# EAGLE design DAM1941_headphone (EAGLE 9.3.1)
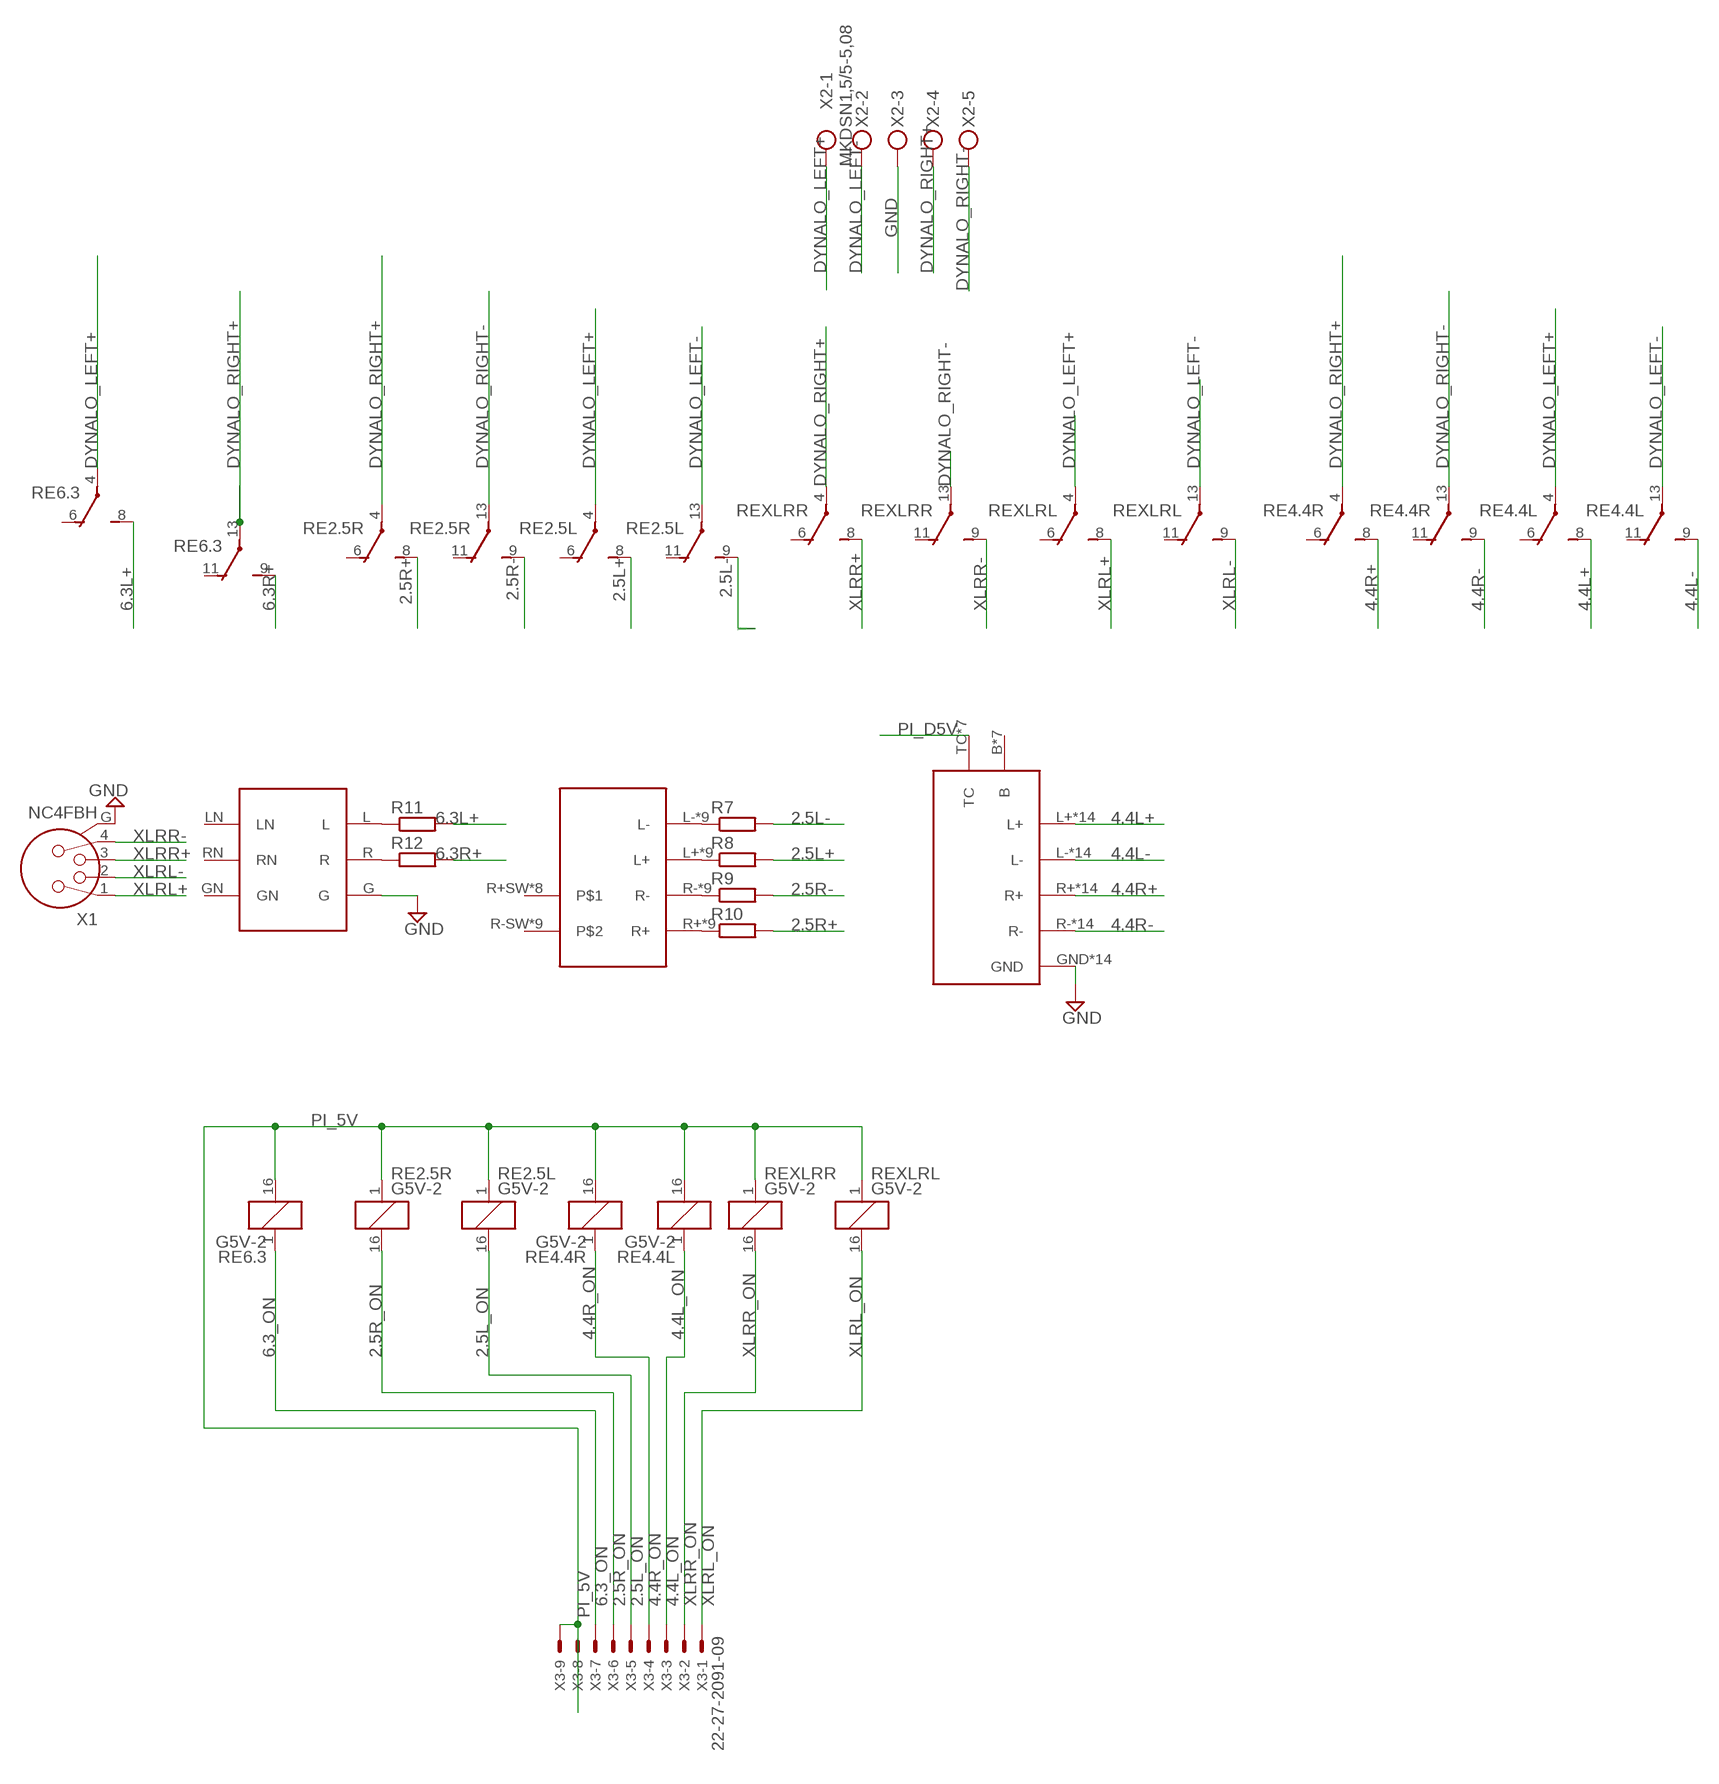
[diagram p0: schematic, sheet 1]

## Parts
R7  R-EU_MELF0204R  [MINI_MELF-0204R]
R8  R-EU_MELF0204R  [MINI_MELF-0204R]
R9  R-EU_MELF0204R  [MINI_MELF-0204R]
R10  R-EU_MELF0204R  [MINI_MELF-0204R]
R11  R-EU_MELF0204R  [MINI_MELF-0204R]
R12  R-EU_MELF0204R  [MINI_MELF-0204R]
RE2.5L  G5V-2  [G5V-2]
RE2.5R  G5V-2  [G5V-2]
RE4.4L  G5V-2  [G5V-2]
RE4.4R  G5V-2  [G5V-2]
RE6.3  G5V-2  [G5V-2]
REXLRL  G5V-2  [G5V-2]
REXLRR  G5V-2  [G5V-2]
U$1  PANTACON_JACK  [PATNACON_JACK]
U$2  CUI2.5MM  [CUI2.5MM]
U$3  NMJ6HCD3  [NMJ6HCD3-AU]
X1  NC4FBH  [NC4FBH]
X2  MKDSN1,5/5-5,08  [MKDSN1,5/5-5,08]
X3  22-27-2091-09  [6410-09]

## Nets
2.5L+: R8.2 RE2.5L.8(1:S)
2.5L-: R7.2 RE2.5L.9(2:S)
2.5L_ON: RE2.5L.16 X3.5
2.5R+: R10.2 RE2.5R.8(1:S)
2.5R-: R9.2 RE2.5R.9(2:S)
2.5R_ON: RE2.5R.16 X3.6
4.4L+: RE4.4L.8(1:S) U$1.L+ U$1.L+1(L+) U$1.L+2(L+) U$1.L+3(L+) U$1.L+4(L+) U$1.L+5(L+) U$1.L+6(L+) U$1.L+7(L+) U$1.L+8(L+) U$1.L+9(L+) U$1.L+10(L+) U$1.L+11(L+) U$1.L+12(L+) U$1.L+13(L+)
4.4L-: RE4.4L.9(2:S) U$1.L- U$1.L-1(L-) U$1.L-2(L-) U$1.L-3(L-) U$1.L-4(L-) U$1.L-5(L-) U$1.L-6(L-) U$1.L-7(L-) U$1.L-8(L-) U$1.L-9(L-) U$1.L-10(L-) U$1.L-11(L-) U$1.L-12(L-) U$1.L-13(L-)
4.4L_ON: RE4.4L.1 X3.3
4.4R+: RE4.4R.8(1:S) U$1.R+ U$1.R+1(R+) U$1.R+2(R+) U$1.R+3(R+) U$1.R+4(R+) U$1.R+5(R+) U$1.R+6(R+) U$1.R+7(R+) U$1.R+8(R+) U$1.R+9(R+) U$1.R+10(R+) U$1.R+11(R+) U$1.R+12(R+) U$1.R+13(R+)
4.4R-: RE4.4R.9(2:S) U$1.R- U$1.R-1(R-) U$1.R-2(R-) U$1.R-3(R-) U$1.R-4(R-) U$1.R-5(R-) U$1.R-6(R-) U$1.R-7(R-) U$1.R-8(R-) U$1.R-9(R-) U$1.R-10(R-) U$1.R-11(R-) U$1.R-12(R-) U$1.R-13(R-)
4.4R_ON: RE4.4R.1 X3.4
6.3_ON: RE6.3.1 X3.7
6.3L+: R11.2 RE6.3.8(1:S)
6.3R+: R12.2 RE6.3.9(2:S)
DYNALO_LEFT+: RE2.5L.4(1:P) RE4.4L.4(1:P) RE6.3.4(1:P) REXLRL.4(1:P) X2.1
DYNALO_LEFT-: RE2.5L.13(2:P) RE4.4L.13(2:P) REXLRL.13(2:P) X2.2
DYNALO_RIGHT+: RE2.5R.4(1:P) RE4.4R.4(1:P) RE6.3.13(2:P) REXLRR.4(1:P) X2.4
DYNALO_RIGHT-: RE2.5R.13(2:P) RE4.4R.13(2:P) REXLRR.13(2:P) X2.5
GND: U$1.GND U$1.GND1(GND) U$1.GND2(GND) U$1.GND3(GND) U$1.GND4(GND) U$1.GND5(GND) U$1.GND6(GND) U$1.GND7(GND) U$1.GND8(GND) U$1.GND9(GND) U$1.GND10(GND) U$1.GND11(GND) U$1.GND12(GND) U$1.GND13(GND) U$3.G X1.G X2.3
N$1: R7.1 U$2.L- U$2.L-1(L-) U$2.L-2(L-) U$2.L-3(L-) U$2.L-4(L-) U$2.L-5(L-) U$2.L-6(L-) U$2.L-7(L-) U$2.L-8(L-)
N$2: R8.1 U$2.L+ U$2.L+1(L+) U$2.L+2(L+) U$2.L+3(L+) U$2.L+4(L+) U$2.L+5(L+) U$2.L+6(L+) U$2.L+7(L+) U$2.L+8(L+)
N$3: R9.1 U$2.R- U$2.R-1(R-) U$2.R-2(R-) U$2.R-3(R-) U$2.R-4(R-) U$2.R-5(R-) U$2.R-6(R-) U$2.R-7(R-) U$2.R-8(R-)
N$4: R10.1 U$2.R+ U$2.R+1(R+) U$2.R+2(R+) U$2.R+3(R+) U$2.R+4(R+) U$2.R+5(R+) U$2.R+6(R+) U$2.R+7(R+) U$2.R+8(R+)
N$5: R11.1 U$3.L
N$8: R12.1 U$3.R
PI_5V: RE2.5L.1 RE2.5R.1 RE4.4L.16 RE4.4R.16 RE6.3.16 REXLRL.1 REXLRR.1 X3.8 X3.9
PI_D5V: U$1.TC U$1.TC1(TC) U$1.TC2(TC) U$1.TC3(TC) U$1.TC4(TC) U$1.TC5(TC) U$1.TC6(TC)
XLRL+: REXLRL.8(1:S) X1.1
XLRL-: REXLRL.9(2:S) X1.2
XLRL_ON: REXLRL.16 X3.1
XLRR+: REXLRR.8(1:S) X1.3
XLRR-: REXLRR.9(2:S) X1.4
XLRR_ON: REXLRR.16 X3.2
Unconnected: RE2.5L.6(1:O) RE2.5L.11(2:O) RE2.5R.6(1:O) RE2.5R.11(2:O) RE4.4L.6(1:O) RE4.4L.11(2:O) RE4.4R.6(1:O) RE4.4R.11(2:O) RE6.3.6(1:O) RE6.3.11(2:O) REXLRL.6(1:O) REXLRL.11(2:O) REXLRR.6(1:O) REXLRR.11(2:O) U$1.B U$1.B1(B) U$1.B2(B) U$1.B3(B) U$1.B4(B) U$1.B5(B) U$1.B6(B) U$2.R+SW U$2.R+SW1 U$2.R+SW2 U$2.R+SW3 U$2.R+SW5 U$2.R+SW6 U$2.R+SW7 U$2.R+SW8 U$2.R-SW U$2.R-SW1 U$2.R-SW2 U$2.R-SW3 U$2.R-SW4 U$2.R-SW5 U$2.R-SW6 U$2.R-SW7 U$2.R-SW8 U$3.GN U$3.LN U$3.RN

## Library data of the parts
R7-R12 = Vwvwbg:R-EU_: RESISTOR, European symbol
RE2.5L RE2.5R RE4.4L RE4.4R RE6.3 REXLRL REXLRR = relay:G5V-2: OMRON PCB Relay Source: http://www.omron.com/ecb/products/pdf/en-g5v2.pdf; MPN: G5V-2 5DC; OC_FARNELL: 9949488; OC_NEWARK: 78K5703
U$1 = Vwvwbg:PANTACON_JACK
U$2 = Vwvwbg:CUI2.5MM
U$3 = Vwvwbg:NMJ6HCD3
X1 = con-neutrik_ag:NC4: Neutrik Audio Connector XLR SERIES Stereo 1/4" jack Source: www.neutrik.com/; OC_FARNELL: unknown; OC_NEWARK: unknown
X2 = Vwvwbg:MKDSN1,5/5-5,08: MKDSN 1,5/ 5-5,08 Printklemme Nennstrom: 13,5 A Nennspannung: 250 V Rastermaß: 5,08 mm Polzahl: 5 Anschlussart: Schraubanschluss Montage: Löten Anschlussrichtung Leiter/Platine: 0 ° Artikelnummer: 1729157 Source: http://eshop.phoenixcontact.com .. 1729157.pdf
X3 = con-molex:22-?-09: CONNECTOR wire to board 2.54 mm (.1 inch) pitch header; MF: MOLEX; OC_FARNELL: unknown; OC_NEWARK: unknown

## Board
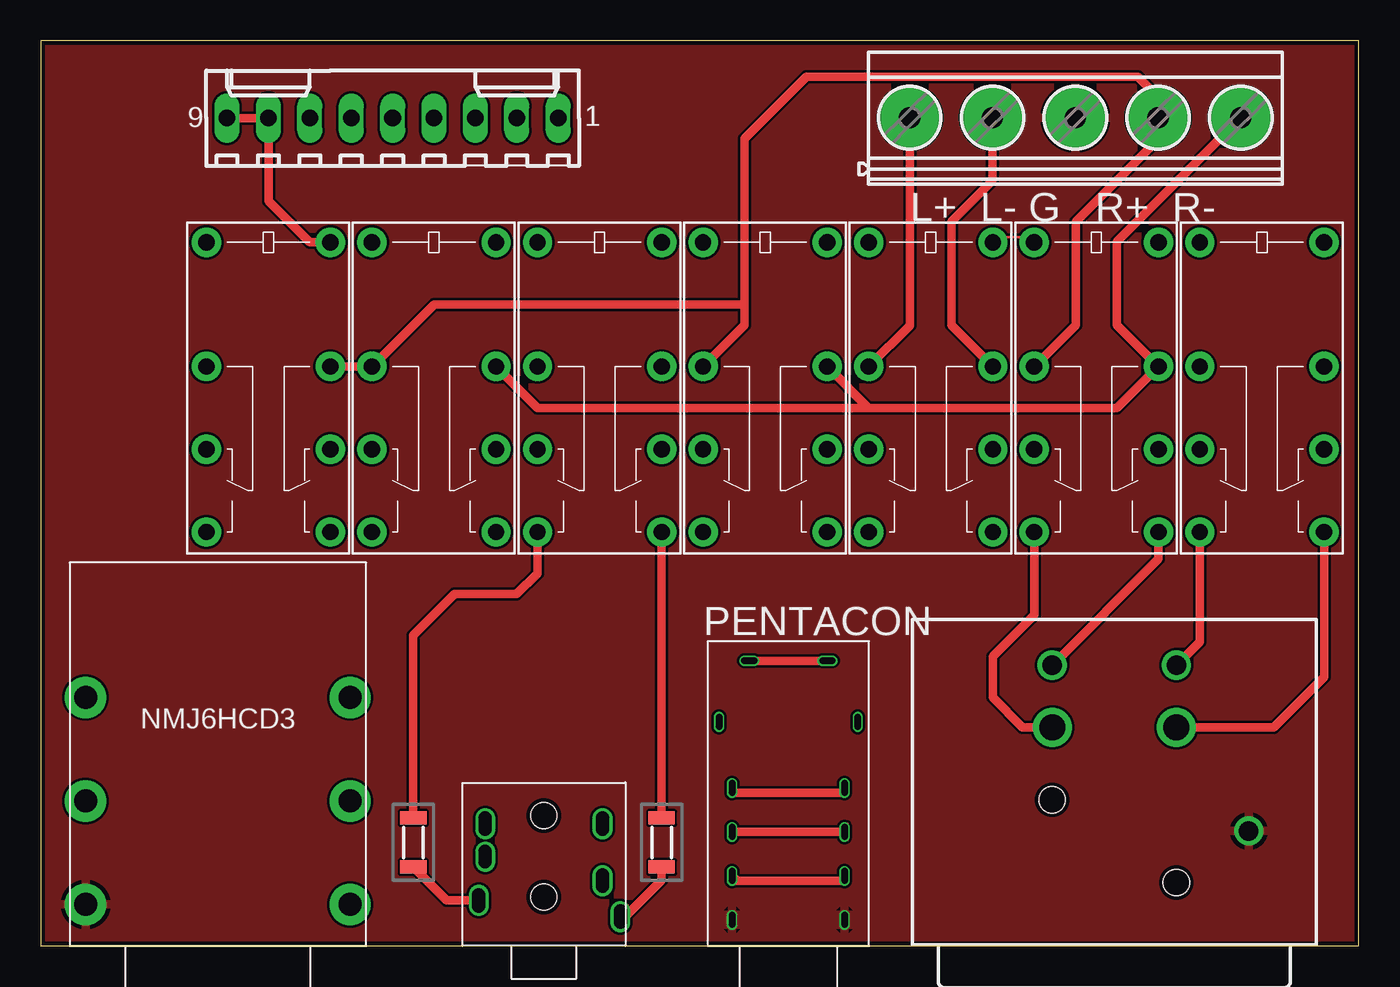
[diagram p1: board, top side]
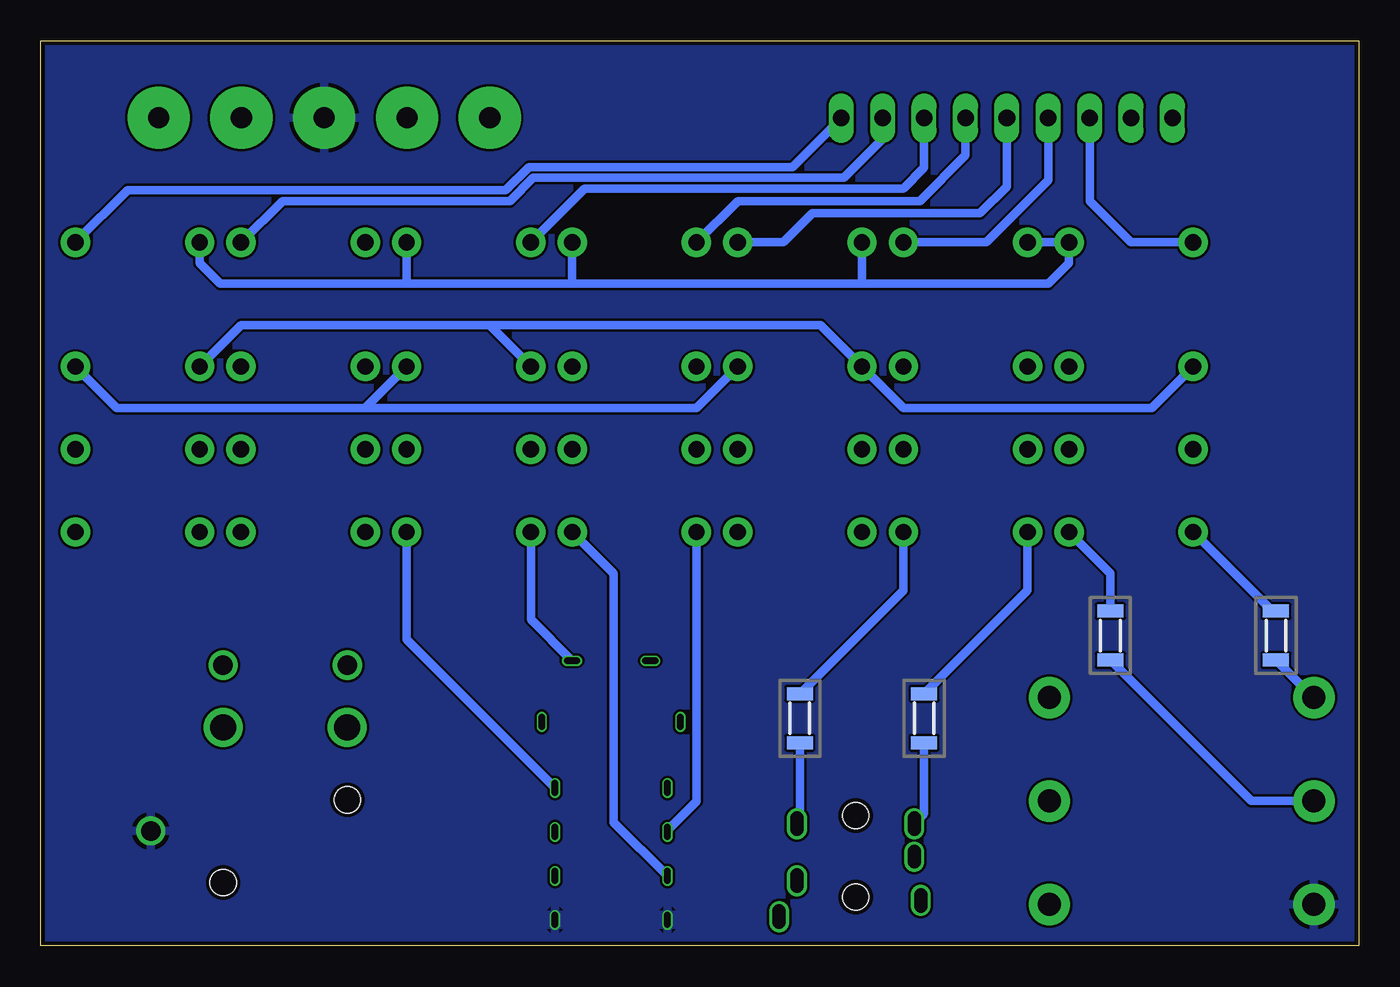
[diagram p2: board, bottom side, seen from below]

Size 80.87 x 55.55 mm. Coordinates in mm from the lower left corner, seen from the top.
Outline: 0,0 80.87,0 80.87,55.55 0,55.55 0,0
Copper layers (1*16): Top 0.035mm / dielectric 1.5mm / Bottom 0.035mm
Design rules "default *": minimum track width 6mil, minimum drill 0.35mm, track to track 6mil, track to pad 6mil, pad to pad 6mil, via to via 6mil, smd to smd 6mil, copper to edge 10mil, drill to drill 6mil, minimum pad ring 0mil, minimum via ring 4mil, stop-mask expansion 4mil, vias tented up to drill 0mil, thermal gap 10mil

### Footprints (pad centres in the part's own frame; a part is rotated, then mirrored left to right if it is on the bottom)
MINI_MELF-0204R = smd 0.8 x 1.6: 1 -1.5,0; 2 1.5,0
G5V-2 = drill 1 pad 1.8: 1 -8.89,-3.81; 4 -1.27,-3.81; 6 3.81,-3.81; 8 8.89,-3.81; 9 8.89,3.81; 11 3.81,3.81; 13 -1.27,3.81; 16 -8.89,3.81
PATNACON_JACK = drill 0.4 pad 0.6: B -4.25,13.75; B1 -4.25,13.85; B2 -4.25,13.95; B3 -4.25,14.05; B4 -4.25,13.65; B5 -4.25,13.55; B6 -4.25,13.45; GND 3.45,1.6; GND1 3.45,1.7; GND2 -3.45,1.6; GND3 3.45,1.8; GND4 3.45,1.9; GND5 3.45,1.5; GND6 3.45,1.4; GND7 3.45,1.3; GND8 -3.45,1.7; GND9 -3.45,1.8; GND10 -3.45,1.9; GND11 -3.45,1.5; GND12 -3.45,1.4; GND13 -3.45,1.3; L+ 2.4,17.5; L+1 2.5,17.5; L+2 -2.4,17.5; L+3 2.6,17.5; L+4 2.7,17.5; L+5 2.3,17.5; L+6 2.2,17.5; L+7 2.1,17.5; L+8 -2.3,17.5; L+9 -2.2,17.5; L+10 -2.1,17.5; L+11 -2.5,17.5; L+12 -2.6,17.5; L+13 -2.7,17.5; L- 3.45,9.7; L-1 3.45,9.6; L-2 -3.45,9.7; L-3 3.45,9.5; L-4 3.45,9.4; L-5 3.45,9.8; L-6 3.45,9.9; L-7 3.45,10; L-8 -3.45,9.8; L-9 -3.45,9.9; L-10 -3.45,10; L-11 -3.45,9.6; L-12 -3.45,9.5; L-13 -3.45,9.4; R+ 3.45,7; R+1 3.45,6.9; R+2 -3.45,7; R+3 3.45,6.8; R+4 3.45,6.7; R+5 3.45,7.1; R+6 3.45,7.2; R+7 3.45,7.3; R+8 -3.45,7.1; R+9 -3.45,7.2; R+10 -3.45,7.3; R+11 -3.45,6.9; R+12 -3.45,6.8; R+13 -3.45,6.7; R- 3.45,4.3; R-1 3.45,4.2; R-2 -3.45,4.3; R-3 3.45,4; R-4 3.45,4.4; R-5 3.45,4.5; R-6 3.45,4.6; R-7 -3.45,4.4; R-8 -3.45,4.5; R-9 3.45,4.1; R-10 -3.45,4.6; R-11 -3.45,4.2; R-12 -3.45,4.1; R-13 -3.45,4; TC 4.25,13.75; TC1 4.25,13.85; TC2 4.25,13.95; TC3 4.25,14.05; TC4 4.25,13.65; TC5 4.25,13.55; TC6 4.25,13.45
CUI2.5MM = drill 0.8 pad 1.1: L+ -4,2.8; L+1 -4,2.9; L+2 -4,3; L+3 -4,3.1; L+4 -4,3.15; L+5 -4,2.7; L+6 -4,2.6; L+7 -4,2.5; L+8 -4,2.45; L- 4.7,1.8; L-1 4.7,1.9; L-2 4.7,2; L-3 4.7,2.1; L-4 4.7,1.7; L-5 4.7,1.6; L-6 4.7,1.5; L-7 4.7,2.15; L-8 4.7,1.45; R+ -3.6,7.5; R+1 -3.6,7.6; R+2 -3.6,7.7; R+3 -3.6,7.8; R+4 -3.6,7.85; R+5 -3.6,7.4; R+6 -3.6,7.3; R+7 -3.6,7.2; R+8 -3.6,7.15; R+SW -3.6,5.5; R+SW1 -3.6,5.6; R+SW2 -3.6,5.7; R+SW3 -3.6,5.8; R+SW5 -3.6,5.4; R+SW6 -3.6,5.3; R+SW7 -3.6,5.2; R+SW8 -3.6,5.15; R- 3.6,7.5; R-1 3.6,7.6; R-2 3.6,7.7; R-3 3.6,7.8; R-4 3.6,7.85; R-5 3.6,7.4; R-6 3.6,7.3; R-7 3.6,7.2; R-8 3.6,7.15; R-SW 3.6,4; R-SW1 3.6,4.1; R-SW2 3.6,4.2; R-SW3 3.6,4.3; R-SW4 3.6,4.35; R-SW5 3.6,3.9; R-SW6 3.6,3.8; R-SW7 3.6,3.7; R-SW8 3.6,3.65 | hole 1.6: 0,3; 0,8
NMJ6HCD3-AU = drill 1.4 pad 2.54: G -8.115,2.55; GN 8.115,2.55; L -8.115,15.25; LN 8.115,15.25; R -8.115,8.9; RN 8.115,8.9
NC4FBH = drill 1.2: 1 -3.81,0.55; 4 3.81,0.55; G -8.25,10.72 | drill 1.6: 2 -3.81,4.365; 3 3.81,4.365 | hole 1.6: -3.81,13.89; 3.81,8.81
MKDSN1,5/5-5,08 = drill 1.3 pad 3.81: 1 -10.181,0.025; 2 -5.101,0.025; 3 -0.021,0.025; 4 5.059,0.025; 5 10.139,0.025
6410-09 = drill 1.016 long: 1 10.16,0; 2 7.62,0; 3 5.08,0; 4 2.54,0; 5 0,0; 6 -2.54,0; 7 -5.08,0; 8 -7.62,0; 9 -10.16,0

### Placement (x,y rotation side)
R7  38.1,6.35 90 top
R8  22.86,6.35 90 top
R9  34.29,13.97 90 bottom
R10  26.67,13.97 90 bottom
R11  5.08,19.05 90 bottom
R12  15.24,19.05 90 bottom
RE2.5L  34.29,34.29 270 top
RE2.5R  24.13,34.29 270 top
RE4.4L  54.61,34.29 270 top
RE4.4R  44.45,34.29 270 top
RE6.3  13.97,34.29 270 top
REXLRL  74.93,34.29 270 top
REXLRR  64.77,34.29 270 top
U$1  45.87,0 0 top
U$2  30.87,0 0 top
U$3  10.87,0 0 top
X1  65.87,17.78 180 top
X2  63.5,50.8 0 top
X3  21.59,50.8 0 top

### Tracks (layer width: path | path; a pad name or v marks a point on that pad's centre or on a via)
2.5L+
  Top 0.508: R8.2 22.86,19.05 25.4,21.59 29.21,21.59 30.48,22.86 RE2.5L.8
2.5L-
  Top 0.508: R7.2 RE2.5L.9
2.5L_ON
  Bottom 0.508: X3.5 21.59,46.61 23.24,44.96 33.53,44.96 35.31,43.18 RE2.5L.16
2.5R+
  Bottom 0.508: R10.2 20.32,21.82 RE2.5R.8
2.5R-
  Bottom 0.508: R9.2 27.94,21.82 RE2.5R.9
2.5R_ON
  Bottom 0.508: X3.6 19.05,46.99 22.86,43.18 RE2.5R.16
4.4L+
  Top 0.152: U$1.L+4 U$1.L+1 | U$1.L+13 U$1.L+12 | U$1.L+2 U$1.L+11 U$1.L+12 | U$1.L+12 U$1.L+9 U$1.L+8 | 48,17.5 U$1.L+
  Top 0.508: U$1.L+9 U$1.L+10 U$1.L+7 48,17.5 U$1.L+6 U$1.L+5 U$1.L+ U$1.L+1
  Bottom 0.508: RE4.4L.8 50.8,20.03 U$1.L+ U$1.L+3
4.4L-
  Top 0.152: 49.5,10 U$1.L-6 | 49.5,10 U$1.L-7 | 49.5,10 U$1.L-5 | 42.5,10 U$1.L-9 | 42.5,10 U$1.L-8 | 49.5,9.5 U$1.L-3 | 49.5,9.5 U$1.L-4 | 42.5,9.5 U$1.L-11 | 42.5,9.5 U$1.L-12 | 42.5,9.5 U$1.L-2 | 42.5,9.5 42.5,10 | 42.5,10 U$1.L-10 | 42.5,9.5 U$1.L-13 | 49.5,9.5 U$1.L- | 49.5,9.5 U$1.L-1
  Top 0.508: U$1.L-13 49.12,9.4 U$1.L-1
  Bottom 0.152: U$1.L-7 49.5,10 49.56,9.94
  Bottom 0.508: U$1.L- 49.56,9.94 58.42,18.8 RE4.4L.9
4.4L_ON
  Bottom 0.508: X3.3 26.67,47.75 27.94,46.48 47.5,46.48 RE4.4L.1
4.4R+
  Top 0.152: 42.5,7 42.5,6.5 U$1.R+13 | 42.5,7 U$1.R+2 | 42.5,7 U$1.R+12 | 42.5,7 42.5,7.5 U$1.R+10 | 42.5,7 U$1.R+11 | 42.5,7 U$1.R+8 | 42.5,7 U$1.R+9 | 49.5,7 49.5,6.5 U$1.R+4 | 49.5,7 U$1.R+3 | 49.5,7 U$1.R+1 | 49.5,7 U$1.R+5 | 49.5,7 49.5,7.5 U$1.R+7 | 49.5,7 U$1.R+ | 49.5,7 U$1.R+6
  Top 0.508: U$1.R+ 42.62,7 U$1.R+9
  Bottom 0.508: RE4.4R.8 40.64,8.88 U$1.R+8
4.4R-
  Top 0.152: 49.5,4.5 U$1.R-6 | 49.5,4.5 U$1.R- | 49.5,4.5 U$1.R-4 | 42.5,4 U$1.R-12 | 42.5,4 U$1.R-13 | 49.5,4 U$1.R-1 | 49.5,4 U$1.R-9 | 42.5,4.5 U$1.R-8 | 42.5,4.5 U$1.R-7 | 42.5,4.5 U$1.R-2 | 42.5,4.5 U$1.R-10 | 42.5,4 U$1.R-11 | 42.5,4 42.61,4.11 | 49.5,4 49.5,4.5 | 49.5,4.5 U$1.R-5 | 49.5,4 U$1.R-3
  Top 0.508: U$1.R-3 42.72,4 42.61,4.11 U$1.R-2
  Bottom 0.508: RE4.4R.9 45.72,22.86 45.72,7.6 U$1.R-2
4.4R_ON
  Bottom 0.508: X3.4 24.13,48.51 26.92,45.72 38.1,45.72 RE4.4R.1
6.3_ON
  Bottom 0.508: X3.7 16.51,45.72 13.97,43.18 RE6.3.1
6.3L+
  Bottom 0.508: R11.2 5.31,20.55 RE6.3.8
6.3R+
  Bottom 0.508: RE6.3.9 15.24,22.86 R12.2
DYNALO_LEFT+
  Top 0.508: X2.1 53.32,38.08 RE4.4L.4
  Bottom 0.508: REXLRL.4 68.58,38.1 53.34,38.1 | 53.34,38.1 RE4.4L.4 | 53.34,38.1 33.02,38.1 RE2.5L.4 27.94,33.02 12.7,33.02 RE6.3.4
DYNALO_LEFT-
  Top 0.508: X2.2 58.4,46.97 55.88,44.45 55.88,38.1 RE4.4L.13
  Bottom 0.508: RE4.4L.13 60.96,33.02 | 60.96,33.02 76.2,33.02 REXLRL.13 | RE2.5L.13 40.64,33.02 60.96,33.02
DYNALO_RIGHT+
  Top 0.508: X2.4 68.56,50.8 | 68.56,50.8 68.56,49.51 63.5,44.45 63.5,38.1 REXLRR.4 | RE4.4R.4 43.18,38.1 43.18,39.37 | 43.18,39.37 43.18,49.53 46.99,53.34 67.31,53.34 69.85,50.8 68.56,50.8 | RE6.3.13 RE2.5R.4 24.13,39.37 43.18,39.37
DYNALO_RIGHT-
  Top 0.508: X2.5 66.04,43.23 66.04,38.1 REXLRR.13 66.04,33.02 50.8,33.02 | 50.8,33.02 RE4.4R.13 | RE2.5R.13 30.48,33.02 50.8,33.02
GND
  pour Bottom: 0,57.15 83.82,57.15 83.82,-3.81 -1.27,-3.81 -1.27,57.15
  pour Top: -2.54,57.15 83.82,57.15 83.82,-3.81 -2.54,-3.81
N$1
  Top 0.152: U$2.L-8 35.5,1.5 U$2.L-1 36,2 | U$2.L-3 36,2.5 U$2.L-7 | 36,2 U$2.L-4 35.5,2 | 36,2 U$2.L-2 | 35.5,2 U$2.L-3 | 35.5,2 U$2.L- | 36,2 U$2.L-3 | 36,2 U$2.L-5 | 36,2 36.03,1.97
  Top 0.508: U$2.L-6 36.03,1.97 38.1,4.03 R7.1
N$2
  Top 0.152: 27,3 U$2.L+3 | 27,3 U$2.L+5 | 27,2.5 U$2.L+7 | 27,3 U$2.L+4 | 27,3 U$2.L+1 27,2.5 | 27,3 U$2.L+6 | 27,2.5 U$2.L+8 27,3 | 27,3 U$2.L+2 | 27,3 U$2.L+
  Top 0.508: R8.1 24.91,2.8 U$2.L+
N$3
  Top 0.152: 34.5,7.5 U$2.R-5 | 34.5,7.5 U$2.R-8 | 34.5,7.5 U$2.R-7 | 34.5,8 U$2.R-4 | 34.5,8 U$2.R-1 | 34.5,8 U$2.R-3 34.5,7.5 | 34.5,8 U$2.R-2 | 34.5,7.5 U$2.R-6 | 34.5,7.5 U$2.R-
  Bottom 0.508: U$2.R- 34.29,7.68 R9.1
N$4
  Top 0.152: 27.5,7.5 U$2.R+3 | 27.5,7.5 U$2.R+7 | 27.5,7.5 U$2.R+8 | 27.5,7.5 U$2.R+1 27.5,8 | 27.5,7.5 U$2.R+6 | 27.5,7.5 U$2.R+4 27.5,8 | 27.5,8 U$2.R+2 27.5,7.5 | 27.5,7.5 U$2.R+5 | 27.5,7.5 U$2.R+
  Bottom 0.508: R10.1 26.67,8.1 U$2.R+
N$5
  Bottom 0.508: U$3.L 2.78,15.25 R11.1
N$8
  Bottom 0.508: R12.1 6.59,8.9 U$3.R
PI_5V
  Top 0.152: REXLRR.1 60.5,43.5 58.5,43.5 RE4.4L.16
  Top 0.508: X3.9 X3.8 13.97,45.72 16.51,43.18 RE6.3.16
  Bottom 0.508: REXLRL.1 71.12,41.91 69.85,40.64 58.42,40.64 | 58.42,40.64 48.26,40.64 | 48.26,40.64 30.48,40.64 | 30.48,40.64 19.05,40.64 17.78,41.91 RE6.3.16 RE2.5R.1 | RE2.5L.1 30.48,40.64 | RE4.4R.16 48.26,40.64 | RE4.4L.16 58.42,40.64
PI_D5V
  Top 0.152: 50,14 U$1.TC3 | 50,13.5 U$1.TC 50,14 | 50,13.5 U$1.TC6 | 50,13.5 U$1.TC4 | 50,13.5 U$1.TC5 | 50,14 U$1.TC2 | 50,14 U$1.TC1
XLRL+
  Top 0.508: X1.1 71.12,18.67 REXLRL.8
XLRL-
  Top 0.508: X1.2 75.64,13.41 78.74,16.51 REXLRL.9
XLRL_ON
  Bottom 0.508: REXLRL.16 75.54,46.38 52.34,46.38 50.92,47.8 34.75,47.8 X3.1
XLRR+
  Top 0.508: REXLRR.8 60.96,20.32 58.42,17.78 58.42,15.24 60.24,13.41 X1.3
XLRR-
  Top 0.508: X1.4 68.58,23.75 REXLRR.9
XLRR_ON
  Bottom 0.508: X3.2 29.21,49.53 31.6,47.14 50.65,47.14 52.07,45.72 66.04,45.72 REXLRR.16

### Text on the board
tPlace: L+ L- G R+ R- | PENTACON